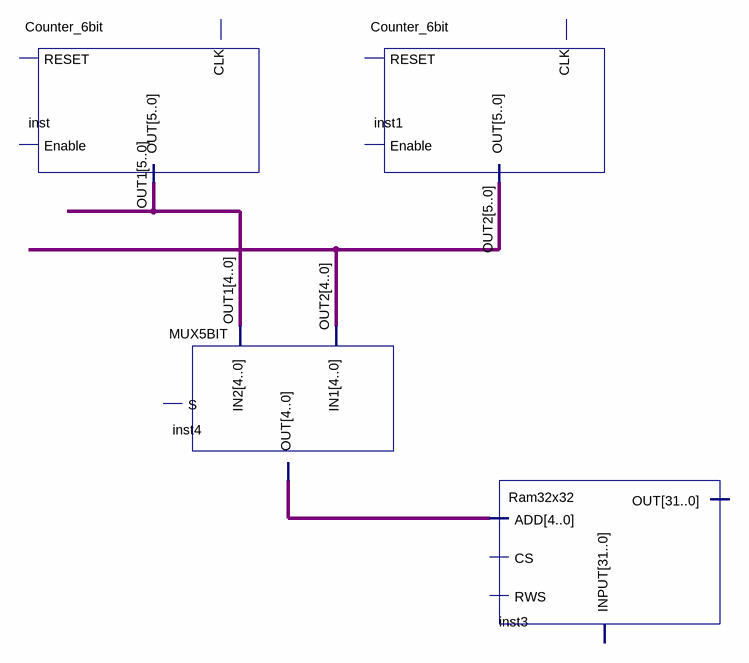
[diagram p0: schematic sheet]
// Quartus schematic Queue.bdf as structural Verilog: 4 symbols, 0 pins
module Queue (
);

  wire [4:0] inst4_out;
  wire [5:0] OUT1, OUT2;

  Counter_6bit inst (.OUT(OUT1));  // open: RESET, Enable, CLK
  MUX5BIT inst4 (.IN1(OUT2[4:0]), .IN2(OUT1[4:0]), .OUT(inst4_out));  // open: S
  Counter_6bit inst1 (.OUT(OUT2));  // open: RESET, Enable, CLK
  Ram32x32 inst3 (.ADD(inst4_out));  // open: INPUT, RWS, CS, OUT
endmodule
